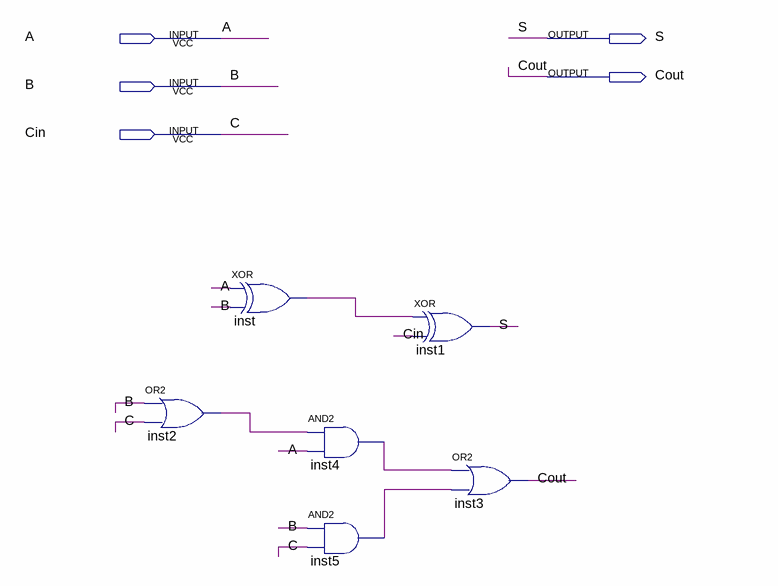
[diagram p0: schematic sheet]
// Quartus schematic g55_adder_single.bdf as structural Verilog: 6 symbols, 5 pins
module g55_adder_single (
  input  A,
  input  B,
  input  Cin,
  output S,
  output Cout
);

  wire inst2_out, inst4_out, inst5_out, inst_out;

  or inst2 (inst2_out, B, Cin);
  xor inst (inst_out, A, B);
  and inst4 (inst4_out, inst2_out, A);
  and inst5 (inst5_out, B, Cin);
  xor inst1 (S, inst_out, Cin);
  or inst3 (Cout, inst4_out, inst5_out);

  // Other names for the same wires on the sheet: C = Cin
endmodule
